# Altium schematic sheet max.SchDoc
size A4; Time: 22/04/18
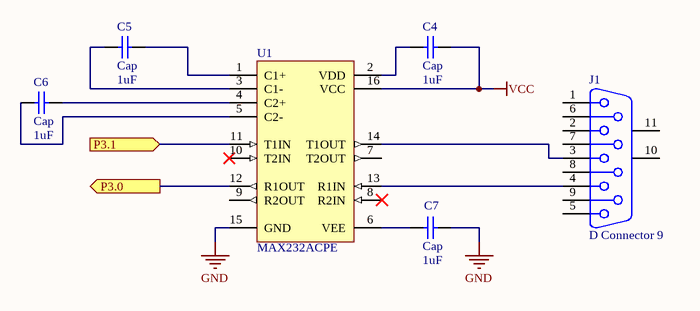
[diagram p0: max.SchDoc]

## Parts
C4  Cap  value 1uF  [RAD-0.3]
C5  Cap  value 1uF  [RAD-0.3]
C6  Cap  value 1uF  [RAD-0.3]
C7  Cap  value 1uF  [RAD-0.3]
J1  D Connector 9  [DSUB1.385-2H9]
U1  MAX232ACPE  [PE16A]

## Ports
P3.0 (out), P3.1 (in)

## Nets
GND: C7.2 U1.15(GND)
VCC: C4.2 U1.16(VCC)
P3.0: U1.12(R1OUT) ; port P3.0
P3.1: U1.11(T1IN) ; port P3.1
NetC4_1: C4.1 U1.2(VDD)
NetC5_1: C5.1 U1.3(C1-)
NetC5_2: C5.2 U1.1(C1+)
NetC6_1: C6.1 U1.5(C2-)
NetC6_2: C6.2 U1.4(C2+)
NetC7_1: C7.1 U1.6(VEE)
NetJ1_3: J1.3 U1.14(T1OUT)
NetJ1_4: J1.4 U1.13(R1IN)

Not connected (* = marked no-connect by the designer): J1 1 2 5 6 7 8 9 10(MH1) 11(MH2); U1 7(T2OUT) 8(R2IN)* 9(R2OUT) 10(T2IN)*

## Notes on the sheet
- 专升本
- 通信工程
- 李烨攀
- 2101班
- 210806300163
- 学号

## Library data of the parts
C4-C7 = Cap: Capacitor; Published: 8-Jun-2000; LatestRevisionDate: 17-Jul-2002; LatestRevisionNote: Re-released for DXP Platform.; PackageReference: RAD-0.3; Publisher: Altium Limited; PackageDescription: Radial Cap, Thru-Hole; 2 Leads; 0.3 in Pin Spacing
J1 = D Connector 9: Receptacle Assembly, 9 Position, Right Angle; PackageDocument: O; Positions: 9; Published: 15-Jun-2001; LatestRevisionDate: 17-Jul-2002; LatestRevisionNote: Re-released for DXP Platform.; DatasheetDocument: 1-Sep-1999; PackageReference: 788750; Publisher: Altium Limited; Orientation: Right Angle; Gender: Receptacle
U1 = MAX232ACPE: +5V Powered, Multi-Channel RS-232 Driver/Receiver; Published: 16-Jan-2001; LatestRevisionDate: 29-May-2009; LatestRevisionNote: Component Body Added.; PackageVersion: 1997; PackageReference: PE16A; Publisher: Altium Limited; PackageDescription: DIP, 16-Pin, Row Spacing 7.62 mm, Pitch 2.54 mm; Code_JEDEC: MS-001-BB; ComponentLink1Description: Manufacturer Link; ComponentLink1URL: http://www.maxim-ic.com/; ComponentLink2Description: Datasheet; ComponentLink2URL: http://pdfserv.maxim-ic.com/en/ds/MAX220-MAX249.pdf